# Altium project CZAR Li-Ion Batt BOT.PrjPcb
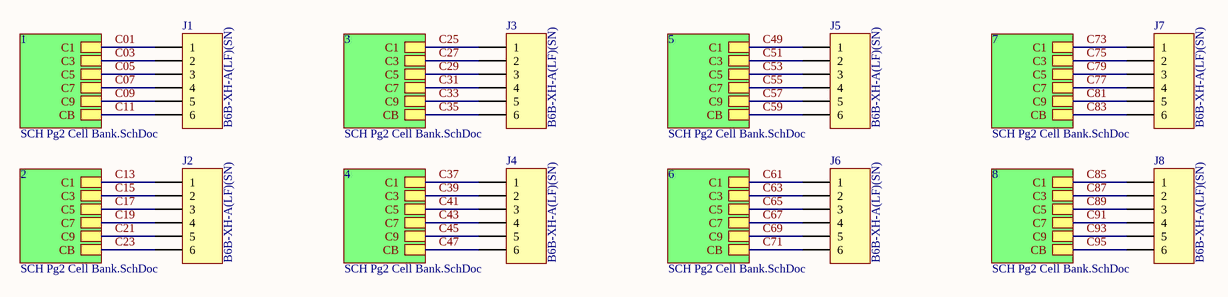
[diagram p0: SCH Pg1 Top Sheet.SchDoc]
2 sheets, 104 parts. Net scope: hierarchical (ports join the sheet entries above them; power ports are global).
Board file: PCB CZAR Li-Ion Batt BOT.PcbDoc
Sheets:
  SCH Pg1 Top Sheet.SchDoc
    1 = SCH Pg2 Cell Bank.SchDoc
    2 = SCH Pg2 Cell Bank.SchDoc
    3 = SCH Pg2 Cell Bank.SchDoc
    4 = SCH Pg2 Cell Bank.SchDoc
    5 = SCH Pg2 Cell Bank.SchDoc
    6 = SCH Pg2 Cell Bank.SchDoc
    7 = SCH Pg2 Cell Bank.SchDoc
    8 = SCH Pg2 Cell Bank.SchDoc

## Sheet SCH Pg1 Top Sheet.SchDoc: CZAR Power - Li-Ion Batt Brd BOT
size Letter; Organization: Adv Power Electronics Lab; Address1: Kettering University; Address2: 1700 University Ave; Address3: Flint, MI 48504; Address4: United States of America; DocumentNumber: 2; SheetNumber: 2; SheetTotal: 7

### Parts
J1  B6B-XH-A(LF)(SN)  [JST-XH-B6]
J2  B6B-XH-A(LF)(SN)  [JST-XH-B6]
J3  B6B-XH-A(LF)(SN)  [JST-XH-B6]
J4  B6B-XH-A(LF)(SN)  [JST-XH-B6]
J5  B6B-XH-A(LF)(SN)  [JST-XH-B6]
J6  B6B-XH-A(LF)(SN)  [JST-XH-B6]
J7  B6B-XH-A(LF)(SN)  [JST-XH-B6]
J8  B6B-XH-A(LF)(SN)  [JST-XH-B6]

### Sub-sheets
1 = SCH Pg2 Cell Bank.SchDoc: C1, C3, C5, C7, C9, CB
2 = SCH Pg2 Cell Bank.SchDoc: C1, C3, C5, C7, C9, CB
3 = SCH Pg2 Cell Bank.SchDoc: C1, C3, C5, C7, C9, CB
4 = SCH Pg2 Cell Bank.SchDoc: C1, C3, C5, C7, C9, CB
5 = SCH Pg2 Cell Bank.SchDoc: C1, C3, C5, C7, C9, CB
6 = SCH Pg2 Cell Bank.SchDoc: C1, C3, C5, C7, C9, CB
7 = SCH Pg2 Cell Bank.SchDoc: C1, C3, C5, C7, C9, CB
8 = SCH Pg2 Cell Bank.SchDoc: C1, C3, C5, C7, C9, CB

### Nets
C01: J1.1 ; sheet 1/C1
C03: J1.2 ; sheet 1/C3
C05: J1.3 ; sheet 1/C5
C07: J1.4 ; sheet 1/C7
C09: J1.5 ; sheet 1/C9
C11: J1.6 ; sheet 1/CB
C13: J2.1 ; sheet 2/C1
C15: J2.2 ; sheet 2/C3
C17: J2.3 ; sheet 2/C5
C19: J2.4 ; sheet 2/C7
C21: J2.5 ; sheet 2/C9
C23: J2.6 ; sheet 2/CB
C25: J3.1 ; sheet 3/C1
C27: J3.2 ; sheet 3/C3
C29: J3.3 ; sheet 3/C5
C31: J3.4 ; sheet 3/C7
C33: J3.5 ; sheet 3/C9
C35: J3.6 ; sheet 3/CB
C37: J4.1 ; sheet 4/C1
C39: J4.2 ; sheet 4/C3
C41: J4.3 ; sheet 4/C5
C43: J4.4 ; sheet 4/C7
C45: J4.5 ; sheet 4/C9
C47: J4.6 ; sheet 4/CB
C49: J5.1 ; sheet 5/C1
C51: J5.2 ; sheet 5/C3
C53: J5.3 ; sheet 5/C5
C55: J5.4 ; sheet 5/C7
C57: J5.5 ; sheet 5/C9
C59: J5.6 ; sheet 5/CB
C61: J6.1 ; sheet 6/C1
C63: J6.2 ; sheet 6/C3
C65: J6.3 ; sheet 6/C5
C67: J6.4 ; sheet 6/C7
C69: J6.5 ; sheet 6/C9
C71: J6.6 ; sheet 6/CB
C73: J7.1 ; sheet 7/C1
C75: J7.2 ; sheet 7/C3
C77: J7.4 ; sheet 7/C7
C79: J7.3 ; sheet 7/C5
C81: J7.5 ; sheet 7/C9
C83: J7.6 ; sheet 7/CB
C85: J8.1 ; sheet 8/C1
C87: J8.2 ; sheet 8/C3
C89: J8.3 ; sheet 8/C5
C91: J8.4 ; sheet 8/C7
C93: J8.5 ; sheet 8/C9
C95: J8.6 ; sheet 8/CB

### Notes on the sheet
- Title
- Size:
- Date:
- Letter
- Number:
- Time:
- Revision:
- Sheet
- of
- File:

### Library data of the parts
J1-J8 = JST B6B-XH-A: Header, JST, 6-Pin, Straight; Supplier 1: Digi-Key; Supplier Part Number 1: 455-2271-ND; Category: J

## Sheet SCH Pg2 Cell Bank.SchDoc: CZAR Power - Li-Ion Batt Brd BOT
size Letter; Organization: Adv Power Electronics Lab; Address1: Kettering University; Address2: 1700 University Ave; Address3: Flint, MI 48504; Address4: United States of America; DocumentNumber: 2; SheetNumber: 2; SheetTotal: 7
Used 8 times, as channels 1, 2, 3, 4, 5, 6, 7, 8. Parts and nets are listed once, with the designators drawn on the sheet.
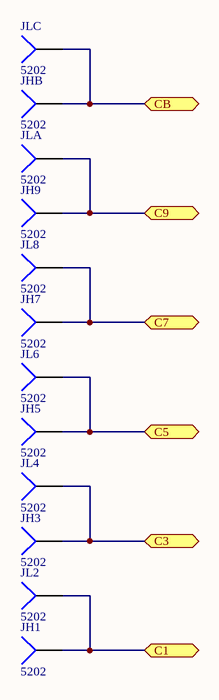
[diagram p1: SCH Pg2 Cell Bank.SchDoc]

### Parts
JH1  5202  [BAT-KS5202-PTH]
JH3  5202  [BAT-KS5202-PTH]
JH5  5202  [BAT-KS5202-PTH]
JH7  5202  [BAT-KS5202-PTH]
JH9  5202  [BAT-KS5202-PTH]
JHB  5202  [BAT-KS5202-PTH]
JL2  5202  [BAT-KS5202-PTH]
JL4  5202  [BAT-KS5202-PTH]
JL6  5202  [BAT-KS5202-PTH]
JL8  5202  [BAT-KS5202-PTH]
JLA  5202  [BAT-KS5202-PTH]
JLC  5202  [BAT-KS5202-PTH]

### Ports
C1, C3, C5, C7, C9, CB

### Nets
C1: JH1.1 JL2.1 ; port C1
C3: JH3.1 JL4.1 ; port C3
C5: JH5.1 JL6.1 ; port C5
C7: JH7.1 JL8.1 ; port C7
C9: JH9.1 JLA.1 ; port C9
CB: JHB.1 JLC.1 ; port CB

### Channels
1: designators end in 1; ports C1=C01 C3=C03 C5=C05 C7=C07 C9=C09 CB=C11
2: designators end in 2; ports C1=C13 C3=C15 C5=C17 C7=C19 C9=C21 CB=C23
3: designators end in 3; ports C1=C25 C3=C27 C5=C29 C7=C31 C9=C33 CB=C35
4: designators end in 4; ports C1=C37 C3=C39 C5=C41 C7=C43 C9=C45 CB=C47
5: designators end in 5; ports C1=C49 C3=C51 C5=C53 C7=C55 C9=C57 CB=C59
6: designators end in 6; ports C1=C61 C3=C63 C5=C65 C7=C67 C9=C69 CB=C71
7: designators end in 7; ports C1=C73 C3=C75 C5=C79 C7=C77 C9=C81 CB=C83
8: designators end in 8; ports C1=C85 C3=C87 C5=C89 C7=C91 C9=C93 CB=C95

### Notes on the sheet
- Title
- Size:
- Date:
- Letter
- Number:
- Time:
- Revision:
- Sheet
- of
- File:

### Library data of the parts
JH1 JH3 JH5 JH7 JH9 JHB JL2 JL4 JL6 JL8 JLA JLC = KS5202: Hardware, Battery Contact Spring, PCB-mount; Category: J; Supplier 1: Digi-Key; Supplier Part Number 1: 36-5202-ND

## Nets that join several sheets
C01: SCH Pg1 Top Sheet (J1.1), 1 (JH11.1 JL21.1)
C03: SCH Pg1 Top Sheet (J1.2), 1 (JH31.1 JL41.1)
C05: SCH Pg1 Top Sheet (J1.3), 1 (JH51.1 JL61.1)
C07: SCH Pg1 Top Sheet (J1.4), 1 (JH71.1 JL81.1)
C09: SCH Pg1 Top Sheet (J1.5), 1 (JH91.1 JLA1.1)
C11: SCH Pg1 Top Sheet (J1.6), 1 (JHB1.1 JLC1.1)
C13: SCH Pg1 Top Sheet (J2.1), 2 (JH12.1 JL22.1)
C15: SCH Pg1 Top Sheet (J2.2), 2 (JH32.1 JL42.1)
C17: SCH Pg1 Top Sheet (J2.3), 2 (JH52.1 JL62.1)
C19: SCH Pg1 Top Sheet (J2.4), 2 (JH72.1 JL82.1)
C21: SCH Pg1 Top Sheet (J2.5), 2 (JH92.1 JLA2.1)
C23: SCH Pg1 Top Sheet (J2.6), 2 (JHB2.1 JLC2.1)
C25: SCH Pg1 Top Sheet (J3.1), 3 (JH13.1 JL23.1)
C27: SCH Pg1 Top Sheet (J3.2), 3 (JH33.1 JL43.1)
C29: SCH Pg1 Top Sheet (J3.3), 3 (JH53.1 JL63.1)
C31: SCH Pg1 Top Sheet (J3.4), 3 (JH73.1 JL83.1)
C33: SCH Pg1 Top Sheet (J3.5), 3 (JH93.1 JLA3.1)
C35: SCH Pg1 Top Sheet (J3.6), 3 (JHB3.1 JLC3.1)
C37: SCH Pg1 Top Sheet (J4.1), 4 (JH14.1 JL24.1)
C39: SCH Pg1 Top Sheet (J4.2), 4 (JH34.1 JL44.1)
C41: SCH Pg1 Top Sheet (J4.3), 4 (JH54.1 JL64.1)
C43: SCH Pg1 Top Sheet (J4.4), 4 (JH74.1 JL84.1)
C45: SCH Pg1 Top Sheet (J4.5), 4 (JH94.1 JLA4.1)
C47: SCH Pg1 Top Sheet (J4.6), 4 (JHB4.1 JLC4.1)
C49: SCH Pg1 Top Sheet (J5.1), 5 (JH15.1 JL25.1)
C51: SCH Pg1 Top Sheet (J5.2), 5 (JH35.1 JL45.1)
C53: SCH Pg1 Top Sheet (J5.3), 5 (JH55.1 JL65.1)
C55: SCH Pg1 Top Sheet (J5.4), 5 (JH75.1 JL85.1)
C57: SCH Pg1 Top Sheet (J5.5), 5 (JH95.1 JLA5.1)
C59: SCH Pg1 Top Sheet (J5.6), 5 (JHB5.1 JLC5.1)
C61: SCH Pg1 Top Sheet (J6.1), 6 (JH16.1 JL26.1)
C63: SCH Pg1 Top Sheet (J6.2), 6 (JH36.1 JL46.1)
C65: SCH Pg1 Top Sheet (J6.3), 6 (JH56.1 JL66.1)
C67: SCH Pg1 Top Sheet (J6.4), 6 (JH76.1 JL86.1)
C69: SCH Pg1 Top Sheet (J6.5), 6 (JH96.1 JLA6.1)
C71: SCH Pg1 Top Sheet (J6.6), 6 (JHB6.1 JLC6.1)
C73: SCH Pg1 Top Sheet (J7.1), 7 (JH17.1 JL27.1)
C75: SCH Pg1 Top Sheet (J7.2), 7 (JH37.1 JL47.1)
C77: SCH Pg1 Top Sheet (J7.4), 7 (JH77.1 JL87.1)
C79: SCH Pg1 Top Sheet (J7.3), 7 (JH57.1 JL67.1)
C81: SCH Pg1 Top Sheet (J7.5), 7 (JH97.1 JLA7.1)
C83: SCH Pg1 Top Sheet (J7.6), 7 (JHB7.1 JLC7.1)
C85: SCH Pg1 Top Sheet (J8.1), 8 (JH18.1 JL28.1)
C87: SCH Pg1 Top Sheet (J8.2), 8 (JH38.1 JL48.1)
C89: SCH Pg1 Top Sheet (J8.3), 8 (JH58.1 JL68.1)
C91: SCH Pg1 Top Sheet (J8.4), 8 (JH78.1 JL88.1)
C93: SCH Pg1 Top Sheet (J8.5), 8 (JH98.1 JLA8.1)
C95: SCH Pg1 Top Sheet (J8.6), 8 (JHB8.1 JLC8.1)